# EAGLE schematic Word-Clock V1.1 (EAGLE 7.3.0)

## Sheet 1 of 3
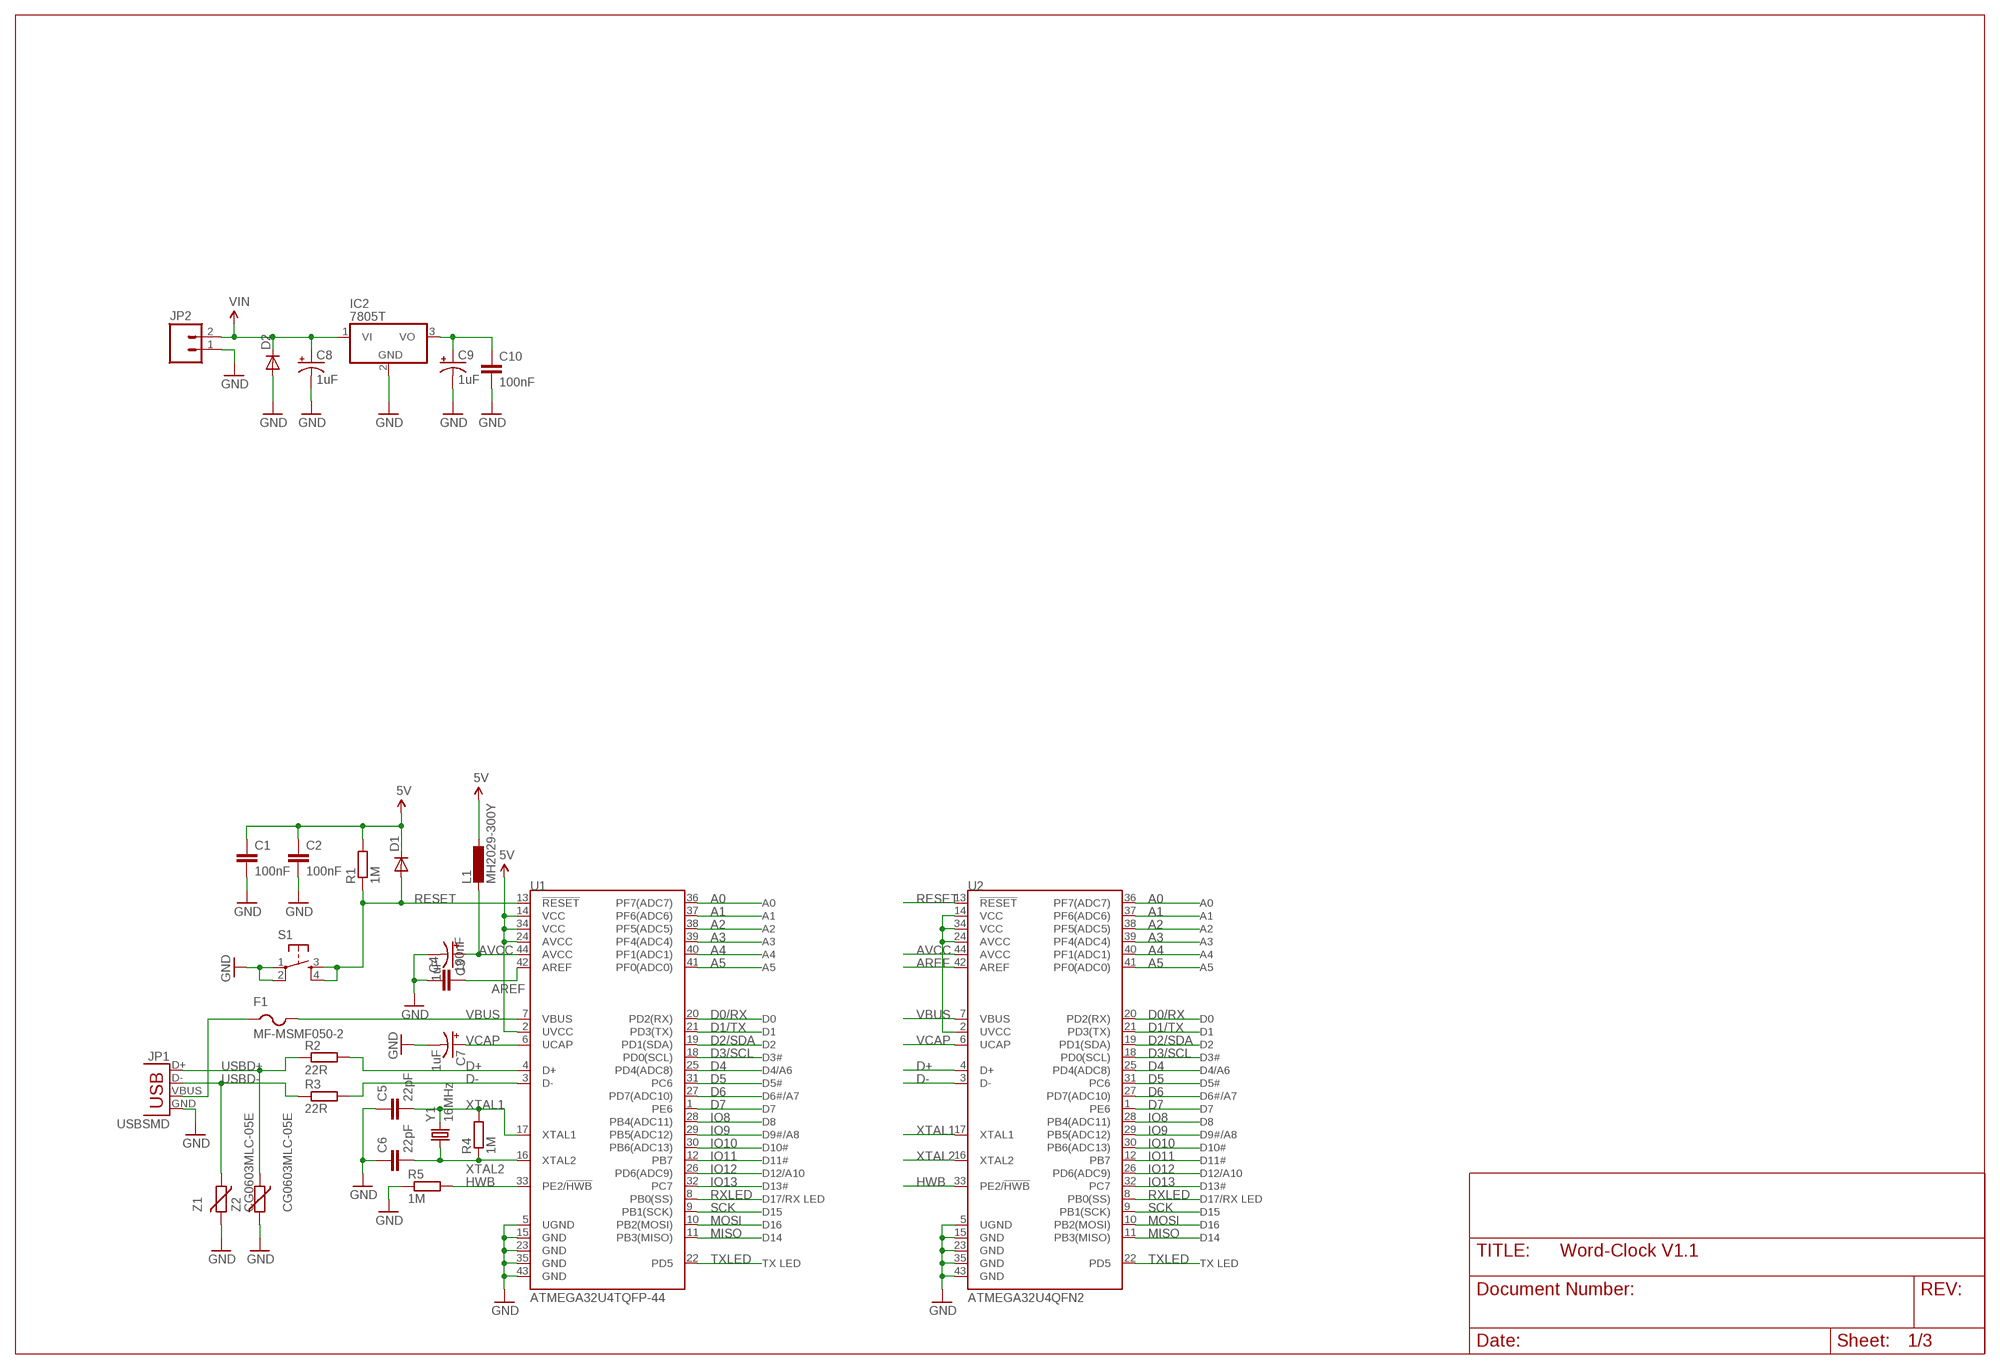
[diagram p0: schematic, sheet 1]

### Parts
C1  100nF  C-EUC1206  [C1206]
C2  100nF  C-EUC1206  [C1206]
C3  1uF  CPOL-USSMCA  [SMC_A]
C4  100nF  C-EUC1206  [C1206]
C5  22pF  C-EUC1206  [C1206]
C6  22pF  C-EUC1206  [C1206]
C7  1uF  CPOL-USSMCA  [SMC_A]
C8  1uF  CPOL-USSMCA  [SMC_A]
C9  1uF  CPOL-USSMCA  [SMC_A]
C10  100nF  C-EUC1206  [C1206]
D1  DIODE-SOD80C  [SOD80C]
D2  DIODE-SOD80C  [SOD80C]
F1  MF-MSMF050-2  PTCFUSE-1206  [R1206]
IC2  7805T  [TO220H]
JP1  USBSMD  [USB-MINIB]
JP2  M02POLAR  [MOLEX-1X2]
L1  MH2029-300Y  L-EUL3225P  [L3225P]
R1  1M  R-EU_R1206  [R1206]
R2  22R  R-EU_R1206  [R1206]
R3  22R  R-EU_R1206  [R1206]
R4  1M  R-EU_R1206  [R1206]
R5  1M  R-EU_R1206  [R1206]
S1  TACTILE-SWITCH-7914G  [7914G]
U1  ATMEGA32U4TQFP-44  [TQFP44]
U2  ATMEGA32U4QFN2  [QFN-44-NOPAD]
Y1  16MHz  CRYSTALSMD  [HC49UP]
Z1  CG0603MLC-05E  VARISTORCN0603  [CT/CN0603]
Z2  CG0603MLC-05E  VARISTORCN0603  [CT/CN0603]

### Nets
5V: C1.1 C2.1 D1.C L1.1 R1.2 U1.2(UVCC) U1.14(VCC) U1.24(AVCC) U1.34(VCC)
A0: U1.36(PF7(ADC7)) U2.36(PF7(ADC7))
A1: U1.37(PF6(ADC6)) U2.37(PF6(ADC6))
A2: U1.38(PF5(ADC5)) U2.38(PF5(ADC5))
A3: U1.39(PF4(ADC4)) U2.39(PF4(ADC4))
A4: U1.40(PF1(ADC1)) U2.40(PF1(ADC1))
A5: U1.41(PF0(ADC0)) U2.41(PF0(ADC0))
AREF: C4.2 U1.42(AREF) U2.42(AREF)
AVCC: C3.+ L1.2 U1.44(AVCC) U2.44(AVCC)
D0/RX: U1.20(PD2(RX)) U2.20(PD2(RX))
D1/TX: U1.21(PD3(TX)) U2.21(PD3(TX))
D2/SDA: U1.19(PD1(SDA)) U2.19(PD1(SDA))
D3/SCL: U1.18(PD0(SCL)) U2.18(PD0(SCL))
D4: U1.25(PD4(ADC8)) U2.25(PD4(ADC8))
D5: U1.31(PC6) U2.31(PC6)
D6: U1.27(PD7(ADC10)) U2.27(PD7(ADC10))
D7: U1.1(PE6) U2.1(PE6)
D+: R2.2 U1.4(D+) U2.4(D+)
D-: R3.2 U1.3(D-) U2.3(D-)
GND: C1.2 C2.2 C3.- C4.1 C5.1 C6.1 C7.- C8.- C9.- C10.2 D2.A IC2.2(GND) JP1.GND JP2.1 R5.1 S1.1 S1.2 U1.5(UGND) U1.15(GND) U1.23(GND) U1.35(GND) U1.43(GND) U2.5(UGND) U2.15(GND) U2.23(GND) U2.35(GND) U2.43(GND) Z1.2 Z2.2
HWB: R5.2 U1.33(PE2/!HWB) U2.33(PE2/!HWB)
IO8: U1.28(PB4(ADC11)) U2.28(PB4(ADC11))
IO9: U1.29(PB5(ADC12)) U2.29(PB5(ADC12))
IO10: U1.30(PB6(ADC13)) U2.30(PB6(ADC13))
IO11: U1.12(PB7) U2.12(PB7)
IO12: U1.26(PD6(ADC9)) U2.26(PD6(ADC9))
IO13: U1.32(PC7) U2.32(PC7)
MISO: U1.11(PB3(MISO)) U2.11(PB3(MISO))
MOSI: U1.10(PB2(MOSI)) U2.10(PB2(MOSI))
N$3: C9.+ C10.1 IC2.3(VO)
N$7: U2.2(UVCC) U2.14(VCC) U2.24(AVCC) U2.34(VCC)
RESET: D1.A R1.1 S1.3 S1.4 U1.13(!RESET) U2.13(!RESET)
RXLED: U1.8(PB0(SS)) U2.8(PB0(SS))
SCK: U1.9(PB1(SCK)) U2.9(PB1(SCK))
TXLED: U1.22(PD5) U2.22(PD5)
USBD+: JP1.D+ R2.1 Z2.1
USBD-: JP1.D- R3.1 Z1.1
VBUS: F1.2 U1.7(VBUS) U2.7(VBUS)
VCAP: C7.+ U1.6(UCAP) U2.6(UCAP)
VIN: C8.+ D2.C IC2.1(VI) JP2.2
XTAL1: C5.2 R4.2 U1.17(XTAL1) U2.17(XTAL1) Y1.2
XTAL2: C6.2 R4.1 U1.16(XTAL2) U2.16(XTAL2) Y1.1
XUSB: F1.1 JP1.VBUS

## Sheet 2 of 3
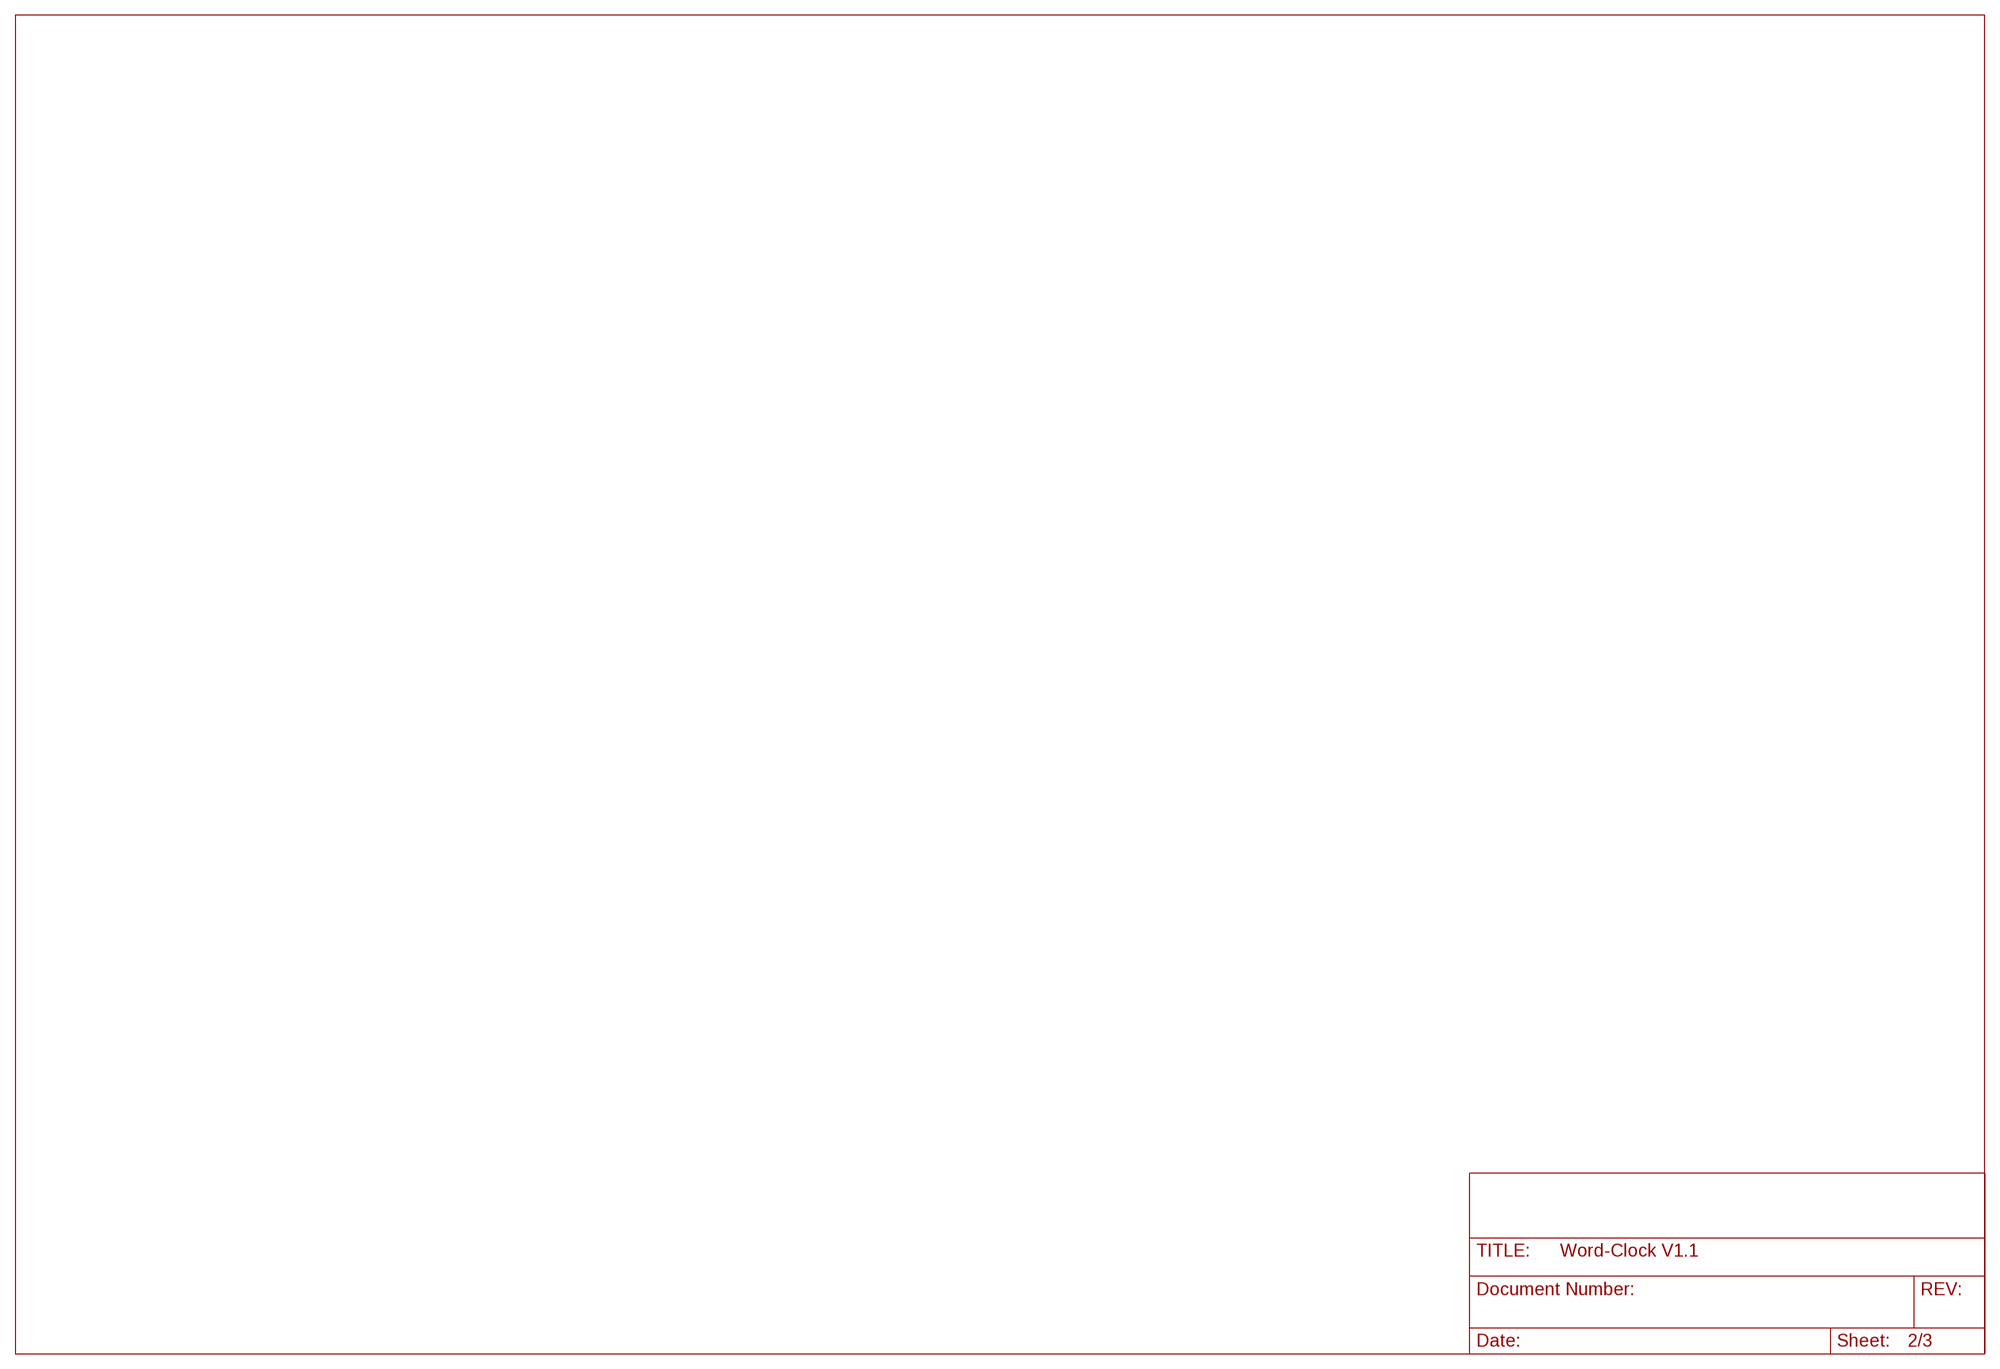
[diagram p1: schematic, sheet 2]

## Sheet 3 of 3
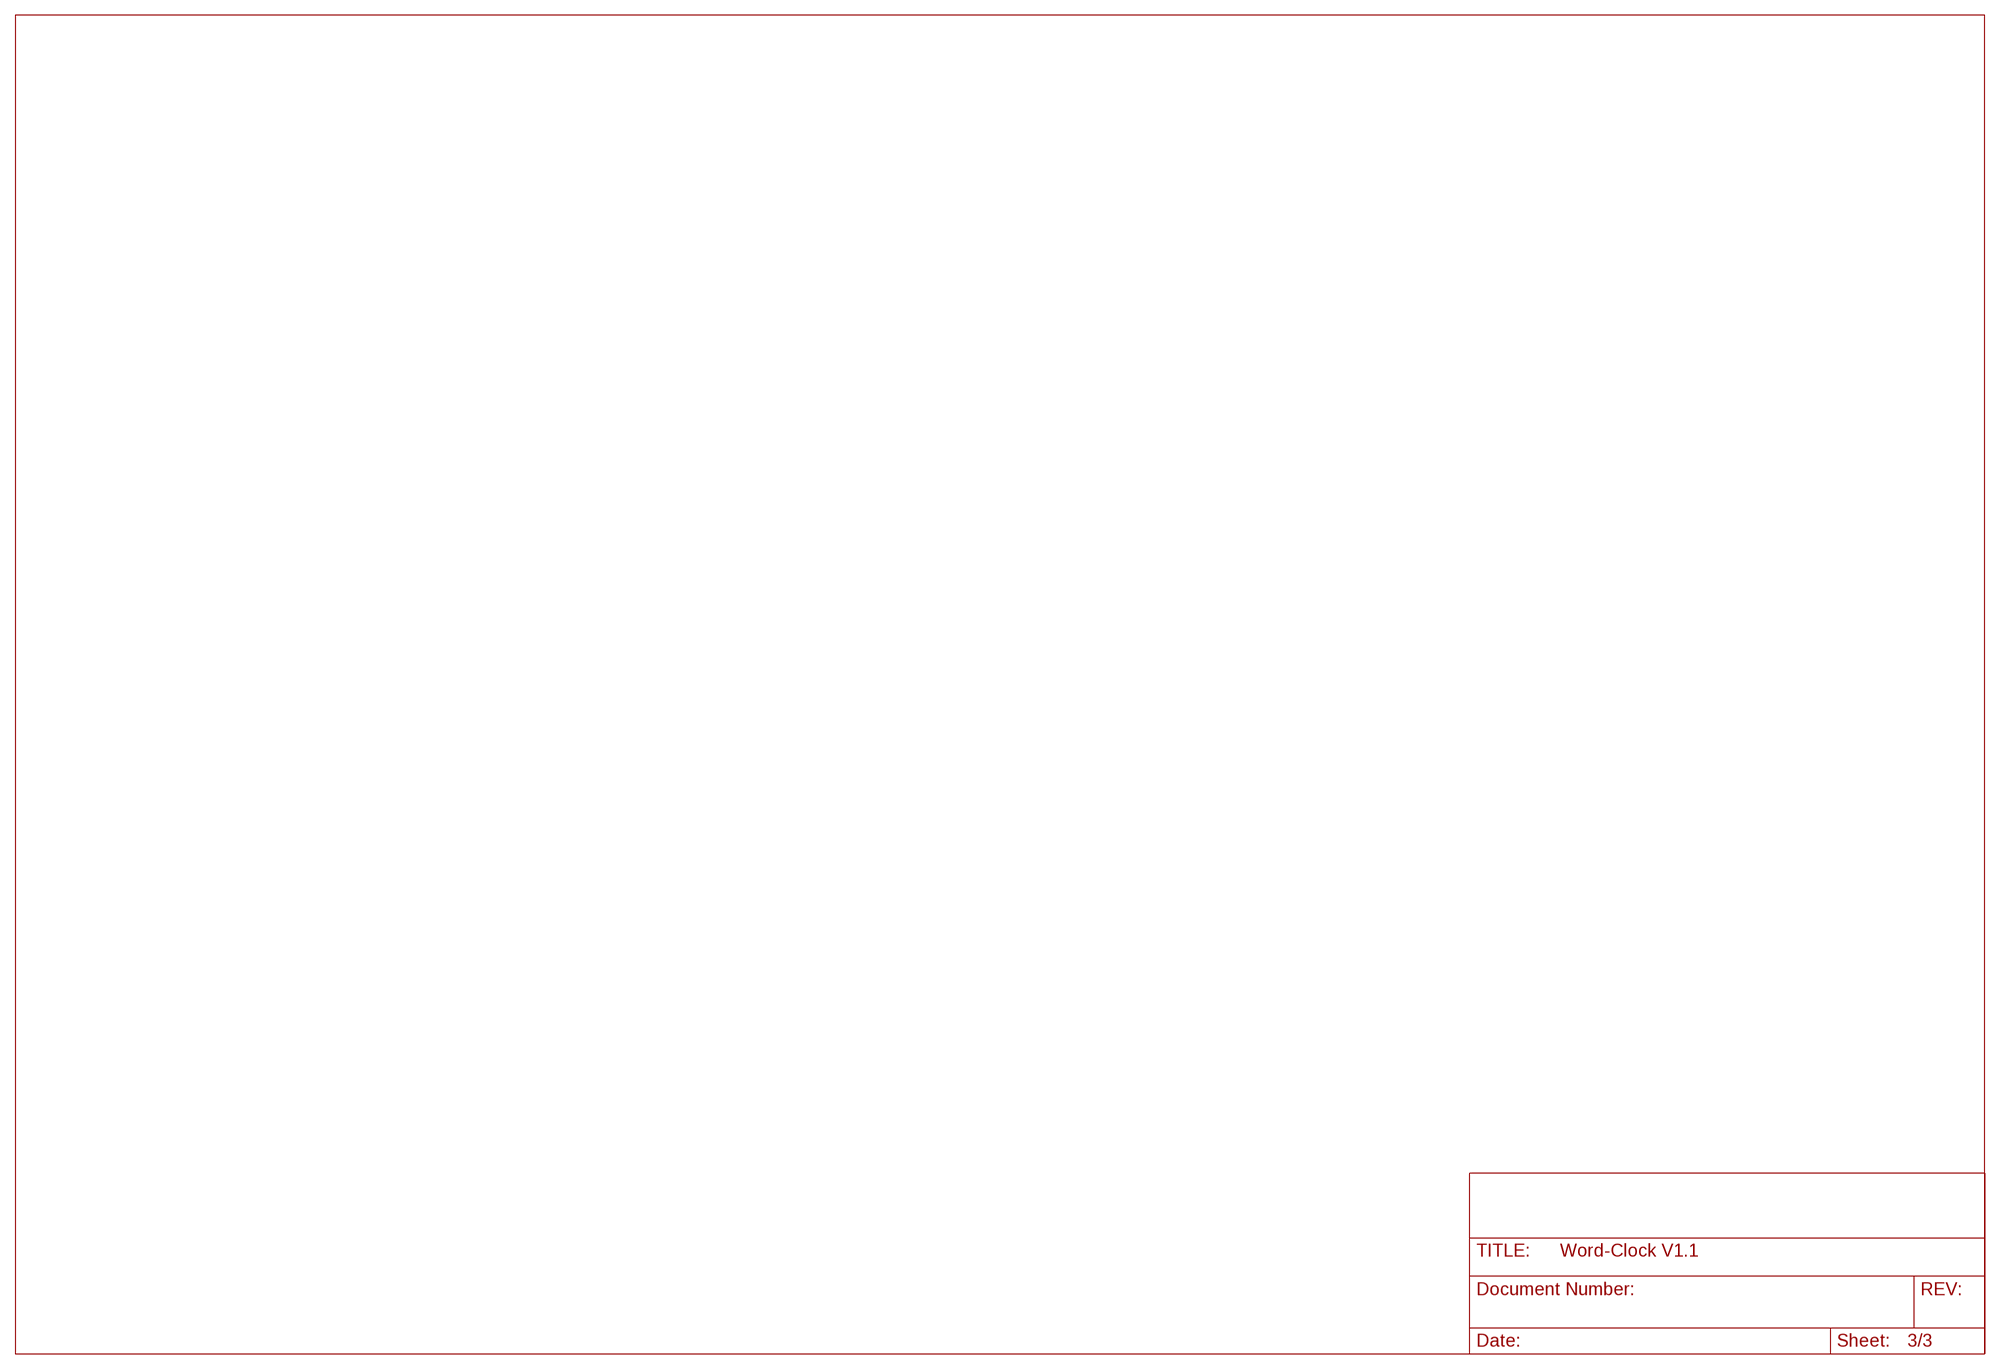
[diagram p2: schematic, sheet 3]

## Library data of the parts
C1 C2 C4-C6 C10 = resistor:C-EU: CAPACITOR, European symbol
C3 C7-C9 = rcl:CPOL-US: POLARIZED CAPACITOR, American symbol
D1 D2 = diode:DIODE-: DIODE
F1 = adafruit:PTCFUSE: PTC fuses, resettable thermistors
IC2 = linear:78*: Positive VOLTAGE REGULATOR Source: http://cache.national.com/ds/LM/LM78L05.pdf http://www.fairchildsemi.com/ds/LM/LM7805.pdf
JP1 = SparkFun-Connectors:USB: USB Connectors USB-B-PTH is fully proven SKU : PRT-00139/CONN-08278 USB-miniB is fully proven SKU : PRT-00587 USB-A-PCB is untested. USB-A-H is throughly reviewed, but untested. Spark Fun Electronics SKU : PRT-00437 USB-B-SMT is throughly reviewed, but untested. Needs silkscreen touching up. USB-A-S has not been used/tested USB-MB-H has not been used/tested USB-MICROB has been used. CONN-09505; PROD_ID: CONN-08193
JP2 = SparkFun-Connectors:M02: Standard 2-pin 0.1" header. Use with - straight break away headers ( PRT-00116) - right angle break away headers (PRT-00553) - swiss pins (PRT-00743) - machine pins (PRT-00117) - female headers (PRT-00115) Molex polarized connector foot print use with: PRT-08233 with associated crimp pins and housings. 2.54_SCREWTERM for use with PRT-10571. 3.5mm Screw Terminal footprints for PRT-08084 5mm Screw Terminal footprints for use with PRT-08432
L1 = resistor:L-EU: INDUCTOR, European symbol
R1-R5 = resistor:R-EU_: RESISTOR, European symbol
S1 = GeekAmmo:TACTILE-SWITCH: Tactile Switch 4 Pins, SPST NO
U1 U2 = SparkFun-DigitalIC:ATMEGA32U4: Atmel 44-pin 8-bit Microcontroller with 32KBytes of ISP Flash and USB Controller
Y1 = SparkFun-FreqCtrl:CRYSTAL: Various standard crystals. Proven footprints.
Z1 Z2 = varistor:VARISTOR: VARISTOR